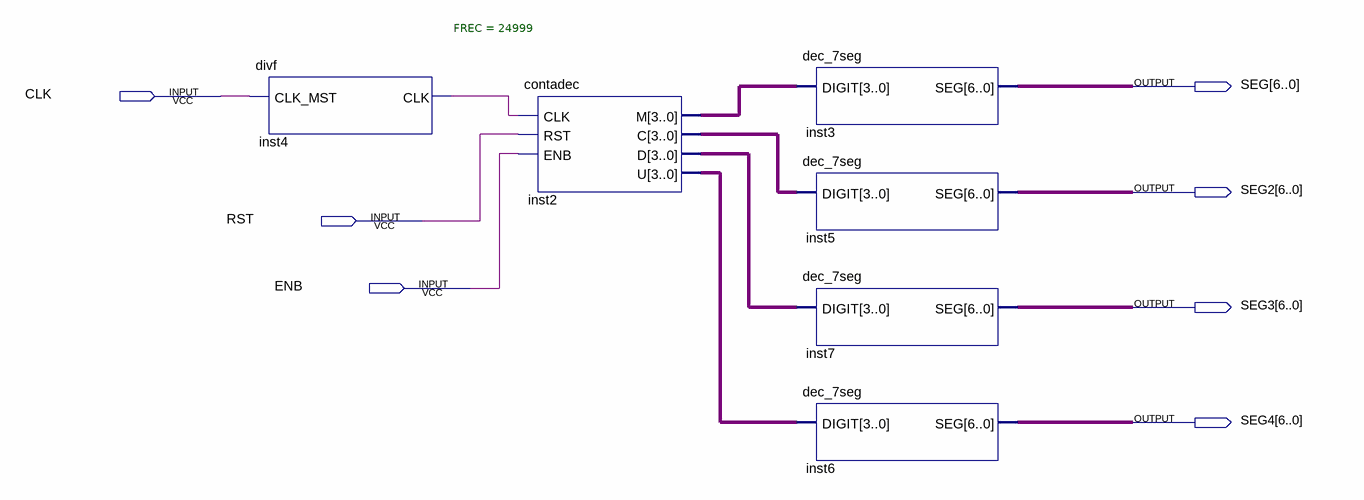
[diagram p0: schematic sheet]
// Quartus schematic Tarea1.bdf as structural Verilog: 6 symbols, 7 pins
module Tarea1 (
  input  CLK,
  input  RST,
  input  ENB,
  output [6:0] SEG,
  output [6:0] SEG2,
  output [6:0] SEG3,
  output [6:0] SEG4
);

  wire inst4_clk;
  wire [3:0] inst2_c, inst2_d, inst2_m, inst2_u;

  divf #(.FREC(24999)) inst4 (.CLK_MST(CLK), .CLK(inst4_clk));
  contadec inst2 (.CLK(inst4_clk), .RST(RST), .ENB(ENB), .M(inst2_m), .C(inst2_c), .D(inst2_d), .U(inst2_u));
  dec_7seg inst3 (.DIGIT(inst2_m), .SEG(SEG));
  dec_7seg inst5 (.DIGIT(inst2_c), .SEG(SEG2));
  dec_7seg inst7 (.DIGIT(inst2_d), .SEG(SEG3));
  dec_7seg inst6 (.DIGIT(inst2_u), .SEG(SEG4));
endmodule
